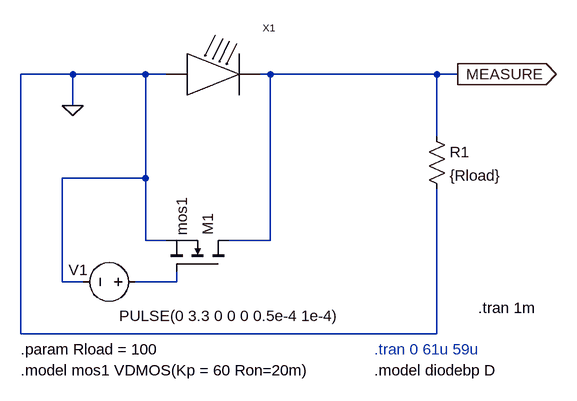
[diagram p0: schematic single.asc]
single.asc, the LTspice schematic file:
Version 4
SHEET 1 1392 876
WIRE -192 144 -272 144
WIRE -80 144 -192 144
WIRE -48 144 -80 144
WIRE 112 144 96 144
WIRE 368 144 112 144
WIRE 400 144 368 144
WIRE -192 192 -192 144
WIRE 368 240 368 144
WIRE -80 304 -80 144
WIRE -80 304 -208 304
WIRE -80 400 -80 304
WIRE -48 400 -80 400
WIRE 112 400 112 144
WIRE 112 400 48 400
WIRE -208 464 -208 304
WIRE -176 464 -208 464
WIRE -32 464 -32 448
WIRE -32 464 -96 464
WIRE -272 544 -272 144
WIRE 368 544 368 320
WIRE 368 544 -272 544
FLAG 400 144 MEASURE
IOPIN 400 144 Out
FLAG -192 192 0
SYMBOL nmos 48 448 M270
SYMATTR InstName M1
SYMATTR Value mos1
SYMBOL voltage -80 464 M270
WINDOW 0 19 118 VLeft 2
WINDOW 3 -52 -300 VRight 2
WINDOW 123 0 0 Left 2
WINDOW 39 0 0 Left 2
SYMATTR InstName V1
SYMATTR Value PULSE(0 3.3 0 0 0 0.5e-4 1e-4)
SYMBOL jacModule 16 144 R0
SYMATTR InstName X1
SYMBOL res 352 224 R0
SYMATTR InstName R1
SYMATTR Value {Rload}
TEXT 272 568 Left 2 ;.tran 0 61u 59u
TEXT -272 600 Left 2 !.model mos1 VDMOS(Kp = 60 Ron=20m)
TEXT 272 600 Left 2 !.model diodebp D
TEXT -272 568 Left 2 !.param Rload = 100
TEXT 432 504 Left 2 !.tran 1m

The netlist it stands for:
* single.asc
M1 MEASURE N001 0 0 mos1
V1 N001 0 PULSE(0 3.3 0 0 0 0.5e-4 1e-4)
XX1 0 MEASURE jacModule  ; pins modIN modOUT
R1 MEASURE 0 {Rload}
.model NMOS NMOS
.model PMOS PMOS
.lib standard.mos
* .tran 0 61u 59u
.model mos1 VDMOS(Kp = 60 Ron=20m)
.model diodebp D
.param Rload = 100
.tran 1m
.backanno
.end